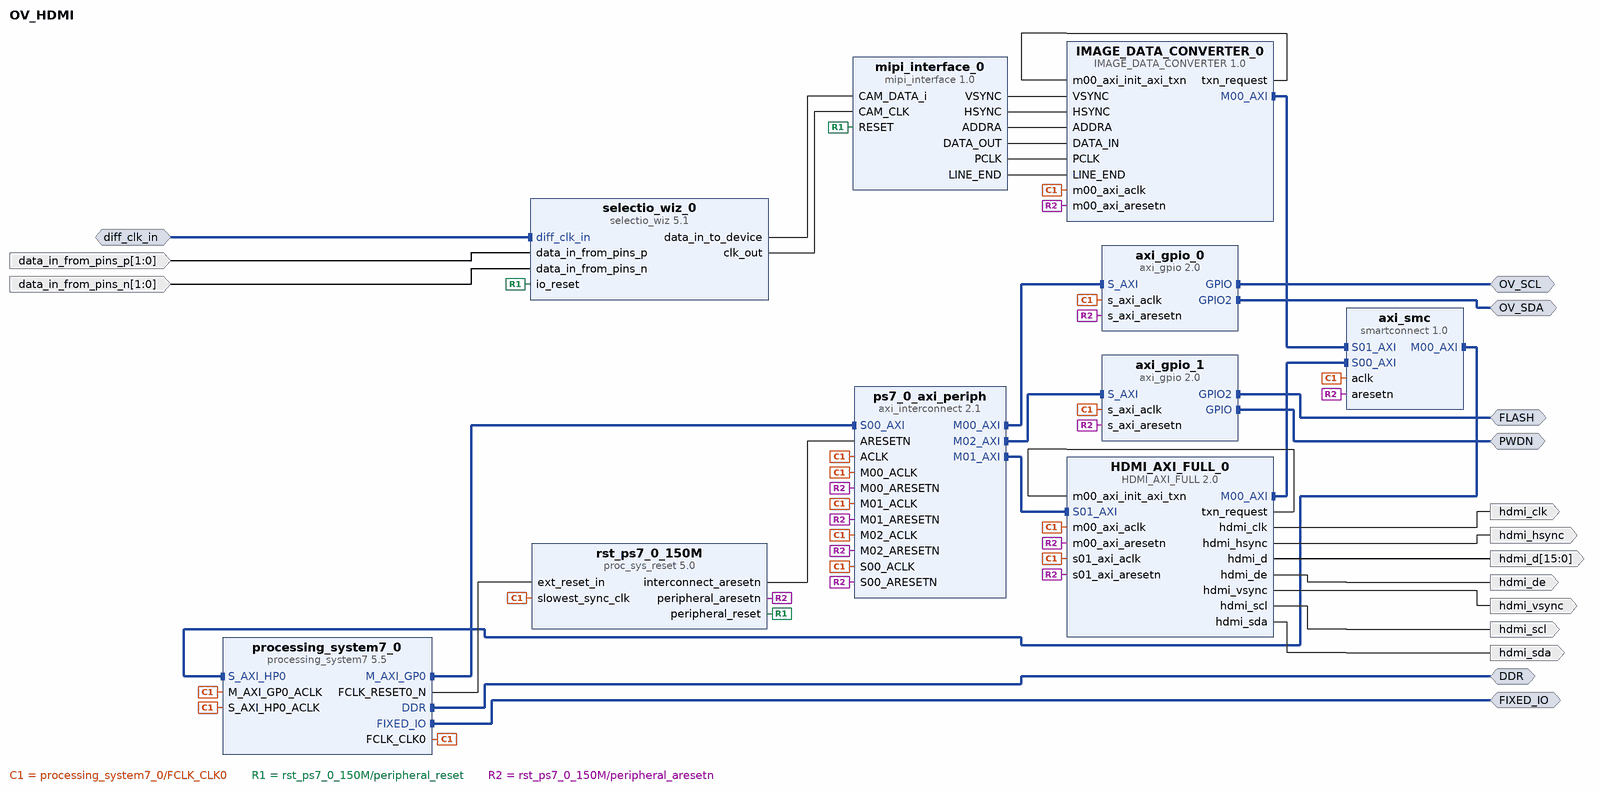
[diagram p0: block diagram of the top level]
# Vivado block design OV_HDMI, xc7z020clg484-1, Vivado 2018.2
create_bd_design OV_HDMI

create_bd_intf_port -mode Master -vlnv xilinx.com:interface:ddrx_rtl:1.0 DDR
create_bd_intf_port -mode Master -vlnv xilinx.com:display_processing_system7:fixedio_rtl:1.0 FIXED_IO
create_bd_intf_port -mode Slave -vlnv xilinx.com:interface:diff_clock_rtl:1.0 diff_clk_in
create_bd_intf_port -mode Master -vlnv xilinx.com:interface:gpio_rtl:1.0 OV_SDA
create_bd_intf_port -mode Master -vlnv xilinx.com:interface:gpio_rtl:1.0 OV_SCL
create_bd_intf_port -mode Master -vlnv xilinx.com:interface:gpio_rtl:1.0 PWDN
create_bd_intf_port -mode Master -vlnv xilinx.com:interface:gpio_rtl:1.0 FLASH
create_bd_port -dir O hdmi_clk
create_bd_port -dir O hdmi_hsync
create_bd_port -dir O hdmi_vsync
create_bd_port -dir O hdmi_de
create_bd_port -dir O -from 15 -to 0 hdmi_d
create_bd_port -dir O hdmi_scl
create_bd_port -dir O hdmi_sda
create_bd_port -dir I -from 1 -to 0 data_in_from_pins_p
create_bd_port -dir I -from 1 -to 0 data_in_from_pins_n

create_bd_cell -type ip -vlnv xilinx.com:ip:processing_system7:5.5 processing_system7_0
set_property -dict [list \
  CONFIG.PCW_SDIO_PERIPHERAL_FREQMHZ 100 \
  CONFIG.PCW_UART_PERIPHERAL_FREQMHZ 100 \
  CONFIG.PCW_FPGA0_PERIPHERAL_FREQMHZ 150 \
  CONFIG.PCW_FPGA1_PERIPHERAL_FREQMHZ 50 \
  CONFIG.PCW_USE_S_AXI_HP0 1 \
  CONFIG.PCW_UIPARAM_DDR_PARTNO {MT41K128M16 HA-15E} \
  CONFIG.PCW_SD0_PERIPHERAL_ENABLE 1 \
  CONFIG.PCW_SD0_SD0_IO {MIO 40 .. 45} \
  CONFIG.PCW_SD0_GRP_CD_ENABLE 0 \
  CONFIG.PCW_SD0_GRP_WP_ENABLE 0 \
  CONFIG.PCW_UART1_PERIPHERAL_ENABLE 1 \
  CONFIG.PCW_UART1_UART1_IO {MIO 48 .. 49} \
  CONFIG.PCW_GPIO_MIO_GPIO_ENABLE 0 \
] [get_bd_cells processing_system7_0]
# 71 more settings of processing_system7_0 are not shown: defaults, MIO pin electricals, DDR timing, and values the tool derives
create_bd_cell -type ip -vlnv xilinx.com:ip:axi_interconnect:2.1 ps7_0_axi_periph
set_property -dict {CONFIG.NUM_MI 3} [get_bd_cells ps7_0_axi_periph]
create_bd_cell -type ip -vlnv xilinx.com:ip:proc_sys_reset:5.0 rst_ps7_0_150M
create_bd_cell -type ip -vlnv xilinx.com:ip:smartconnect:1.0 axi_smc
set_property -dict {CONFIG.NUM_SI 2} [get_bd_cells axi_smc]
create_bd_cell -type ip -vlnv xilinx.com:ip:selectio_wiz:5.1 selectio_wiz_0
set_property -dict [list \
  CONFIG.BUS_SIG_TYPE DIFF \
  CONFIG.BUS_IO_STD LVDS_25 \
  CONFIG.SELIO_ACTIVE_EDGE DDR \
  CONFIG.SERIALIZATION_FACTOR 4 \
  CONFIG.SYSTEM_DATA_WIDTH 2 \
  CONFIG.SELIO_INTERFACE_TYPE NETWORKING \
  CONFIG.SELIO_CLK_SIG_TYPE DIFF \
  CONFIG.SELIO_CLK_IO_STD LVDS_25 \
  CONFIG.CLK_FWD_SIG_TYPE DIFF \
  CONFIG.CLK_FWD_IO_STD LVDS_25 \
] [get_bd_cells selectio_wiz_0]
create_bd_cell -type ip -vlnv xilinx.com:ip:axi_gpio:2.0 axi_gpio_0
set_property -dict {CONFIG.C_GPIO_WIDTH 1 CONFIG.C_GPIO2_WIDTH 1 CONFIG.C_IS_DUAL 1} [get_bd_cells axi_gpio_0]
create_bd_cell -type ip -vlnv xilinx.com:ip:axi_gpio:2.0 axi_gpio_1
set_property -dict {CONFIG.C_GPIO_WIDTH 1 CONFIG.C_GPIO2_WIDTH 1 CONFIG.C_IS_DUAL 1} [get_bd_cells axi_gpio_1]
create_bd_cell -type ip -vlnv xilinx.com:user:HDMI_AXI_FULL:2.0 HDMI_AXI_FULL_0
set_property -dict [list \
  CONFIG.C_M00_AXI_BURST_LEN 64 \
  CONFIG.C_M00_AXI_AWUSER_WIDTH 0 \
  CONFIG.C_M00_AXI_ARUSER_WIDTH 0 \
  CONFIG.C_M00_AXI_WUSER_WIDTH 0 \
  CONFIG.C_M00_AXI_RUSER_WIDTH 0 \
  CONFIG.C_M00_AXI_BUSER_WIDTH 0 \
] [get_bd_cells HDMI_AXI_FULL_0]
create_bd_cell -type ip -vlnv xilinx.com:user:mipi_interface:1.0 mipi_interface_0
create_bd_cell -type ip -vlnv xilinx.com:user:IMAGE_DATA_CONVERTER:1.0 IMAGE_DATA_CONVERTER_0
set_property -dict [list \
  CONFIG.C_M00_AXI_TARGET_SLAVE_BASE_ADDR 0x10000000 \
  CONFIG.C_M00_AXI_BURST_LEN 64 \
  CONFIG.C_M00_AXI_AWUSER_WIDTH 0 \
  CONFIG.C_M00_AXI_ARUSER_WIDTH 0 \
  CONFIG.C_M00_AXI_WUSER_WIDTH 0 \
  CONFIG.C_M00_AXI_RUSER_WIDTH 0 \
  CONFIG.C_M00_AXI_BUSER_WIDTH 0 \
] [get_bd_cells IMAGE_DATA_CONVERTER_0]

# ---- connections ----

connect_bd_intf_net [get_bd_intf_pins processing_system7_0/M_AXI_GP0] [get_bd_intf_pins ps7_0_axi_periph/S00_AXI]
connect_bd_intf_net [get_bd_intf_pins HDMI_AXI_FULL_0/M00_AXI] [get_bd_intf_pins axi_smc/S00_AXI]
connect_bd_intf_net [get_bd_intf_pins axi_smc/M00_AXI] [get_bd_intf_pins processing_system7_0/S_AXI_HP0]
connect_bd_intf_net [get_bd_intf_pins ps7_0_axi_periph/M01_AXI] [get_bd_intf_pins HDMI_AXI_FULL_0/S01_AXI]
connect_bd_intf_net [get_bd_intf_pins ps7_0_axi_periph/M00_AXI] [get_bd_intf_pins axi_gpio_0/S_AXI]
connect_bd_intf_net [get_bd_intf_pins IMAGE_DATA_CONVERTER_0/M00_AXI] [get_bd_intf_pins axi_smc/S01_AXI]
connect_bd_intf_net [get_bd_intf_pins ps7_0_axi_periph/M02_AXI] [get_bd_intf_pins axi_gpio_1/S_AXI]
connect_bd_intf_net [get_bd_intf_ports DDR] [get_bd_intf_pins processing_system7_0/DDR]
connect_bd_intf_net [get_bd_intf_ports FIXED_IO] [get_bd_intf_pins processing_system7_0/FIXED_IO]
connect_bd_intf_net -intf_net diff_clk_in_0_1 [get_bd_intf_ports diff_clk_in] [get_bd_intf_pins selectio_wiz_0/diff_clk_in]
connect_bd_intf_net [get_bd_intf_ports OV_SDA] [get_bd_intf_pins axi_gpio_0/GPIO2]
connect_bd_intf_net [get_bd_intf_ports OV_SCL] [get_bd_intf_pins axi_gpio_0/GPIO]
connect_bd_intf_net [get_bd_intf_ports PWDN] [get_bd_intf_pins axi_gpio_1/GPIO]
connect_bd_intf_net [get_bd_intf_ports FLASH] [get_bd_intf_pins axi_gpio_1/GPIO2]
connect_bd_net [get_bd_pins processing_system7_0/FCLK_CLK0] \
  [get_bd_pins processing_system7_0/M_AXI_GP0_ACLK] [get_bd_pins rst_ps7_0_150M/slowest_sync_clk] [get_bd_pins axi_smc/aclk] \
  [get_bd_pins processing_system7_0/S_AXI_HP0_ACLK] [get_bd_pins axi_gpio_0/s_axi_aclk] [get_bd_pins axi_gpio_1/s_axi_aclk] \
  [get_bd_pins HDMI_AXI_FULL_0/m00_axi_aclk] [get_bd_pins HDMI_AXI_FULL_0/s01_axi_aclk] \
  [get_bd_pins IMAGE_DATA_CONVERTER_0/m00_axi_aclk] [get_bd_pins ps7_0_axi_periph/S00_ACLK] \
  [get_bd_pins ps7_0_axi_periph/M00_ACLK] [get_bd_pins ps7_0_axi_periph/ACLK] [get_bd_pins ps7_0_axi_periph/M01_ACLK] \
  [get_bd_pins ps7_0_axi_periph/M02_ACLK]
connect_bd_net [get_bd_pins processing_system7_0/FCLK_RESET0_N] [get_bd_pins rst_ps7_0_150M/ext_reset_in]
connect_bd_net [get_bd_pins rst_ps7_0_150M/interconnect_aresetn] [get_bd_pins ps7_0_axi_periph/ARESETN]
connect_bd_net [get_bd_pins HDMI_AXI_FULL_0/txn_request] [get_bd_pins HDMI_AXI_FULL_0/m00_axi_init_axi_txn]
connect_bd_net [get_bd_pins HDMI_AXI_FULL_0/hdmi_clk] [get_bd_ports hdmi_clk]
connect_bd_net [get_bd_pins HDMI_AXI_FULL_0/hdmi_hsync] [get_bd_ports hdmi_hsync]
connect_bd_net [get_bd_pins HDMI_AXI_FULL_0/hdmi_vsync] [get_bd_ports hdmi_vsync]
connect_bd_net [get_bd_pins HDMI_AXI_FULL_0/hdmi_de] [get_bd_ports hdmi_de]
connect_bd_net [get_bd_pins HDMI_AXI_FULL_0/hdmi_d] [get_bd_ports hdmi_d]
connect_bd_net [get_bd_pins HDMI_AXI_FULL_0/hdmi_scl] [get_bd_ports hdmi_scl]
connect_bd_net [get_bd_pins HDMI_AXI_FULL_0/hdmi_sda] [get_bd_ports hdmi_sda]
connect_bd_net -net data_in_from_pins_p_0_1 [get_bd_ports data_in_from_pins_p] [get_bd_pins selectio_wiz_0/data_in_from_pins_p]
connect_bd_net -net data_in_from_pins_n_0_1 [get_bd_ports data_in_from_pins_n] [get_bd_pins selectio_wiz_0/data_in_from_pins_n]
connect_bd_net [get_bd_pins selectio_wiz_0/data_in_to_device] [get_bd_pins mipi_interface_0/CAM_DATA_i]
connect_bd_net [get_bd_pins mipi_interface_0/VSYNC] [get_bd_pins IMAGE_DATA_CONVERTER_0/VSYNC]
connect_bd_net [get_bd_pins mipi_interface_0/HSYNC] [get_bd_pins IMAGE_DATA_CONVERTER_0/HSYNC]
connect_bd_net [get_bd_pins mipi_interface_0/ADDRA] [get_bd_pins IMAGE_DATA_CONVERTER_0/ADDRA]
connect_bd_net [get_bd_pins mipi_interface_0/DATA_OUT] [get_bd_pins IMAGE_DATA_CONVERTER_0/DATA_IN]
connect_bd_net [get_bd_pins IMAGE_DATA_CONVERTER_0/txn_request] [get_bd_pins IMAGE_DATA_CONVERTER_0/m00_axi_init_axi_txn]
connect_bd_net [get_bd_pins rst_ps7_0_150M/peripheral_reset] [get_bd_pins selectio_wiz_0/io_reset] [get_bd_pins mipi_interface_0/RESET]
connect_bd_net [get_bd_pins mipi_interface_0/PCLK] [get_bd_pins IMAGE_DATA_CONVERTER_0/PCLK]
connect_bd_net [get_bd_pins selectio_wiz_0/clk_out] [get_bd_pins mipi_interface_0/CAM_CLK]
connect_bd_net [get_bd_pins rst_ps7_0_150M/peripheral_aresetn] \
  [get_bd_pins axi_smc/aresetn] [get_bd_pins axi_gpio_1/s_axi_aresetn] [get_bd_pins axi_gpio_0/s_axi_aresetn] \
  [get_bd_pins HDMI_AXI_FULL_0/m00_axi_aresetn] [get_bd_pins HDMI_AXI_FULL_0/s01_axi_aresetn] \
  [get_bd_pins IMAGE_DATA_CONVERTER_0/m00_axi_aresetn] [get_bd_pins ps7_0_axi_periph/M02_ARESETN] \
  [get_bd_pins ps7_0_axi_periph/M01_ARESETN] [get_bd_pins ps7_0_axi_periph/M00_ARESETN] \
  [get_bd_pins ps7_0_axi_periph/S00_ARESETN]
connect_bd_net [get_bd_pins mipi_interface_0/LINE_END] [get_bd_pins IMAGE_DATA_CONVERTER_0/LINE_END]

# ---- address map ----
assign_bd_address -offset 0x00000000 -range 512M -target_address_space [get_bd_addr_spaces HDMI_AXI_FULL_0/M00_AXI] [get_bd_addr_segs processing_system7_0/S_AXI_HP0/HP0_DDR_LOWOCM]
assign_bd_address -offset 0x00000000 -range 512M -target_address_space [get_bd_addr_spaces IMAGE_DATA_CONVERTER_0/M00_AXI] [get_bd_addr_segs processing_system7_0/S_AXI_HP0/HP0_DDR_LOWOCM]
assign_bd_address -offset 0x41200000 -range 64K -target_address_space [get_bd_addr_spaces processing_system7_0/Data] [get_bd_addr_segs axi_gpio_0/S_AXI/Reg]
assign_bd_address -offset 0x41210000 -range 64K -target_address_space [get_bd_addr_spaces processing_system7_0/Data] [get_bd_addr_segs axi_gpio_1/S_AXI/Reg]
assign_bd_address -offset 0x43C00000 -range 64K -target_address_space [get_bd_addr_spaces processing_system7_0/Data] [get_bd_addr_segs HDMI_AXI_FULL_0/S01_AXI/S01_AXI_reg]

validate_bd_design
save_bd_design
